# Altium schematic sheet Whitespace_Daughtercard_notes.SchDoc: Misc. Project Notes
size A; Author: Ryan E. Guerra; Revision: 1.0; SheetNumber: 10; SheetTotal: 10
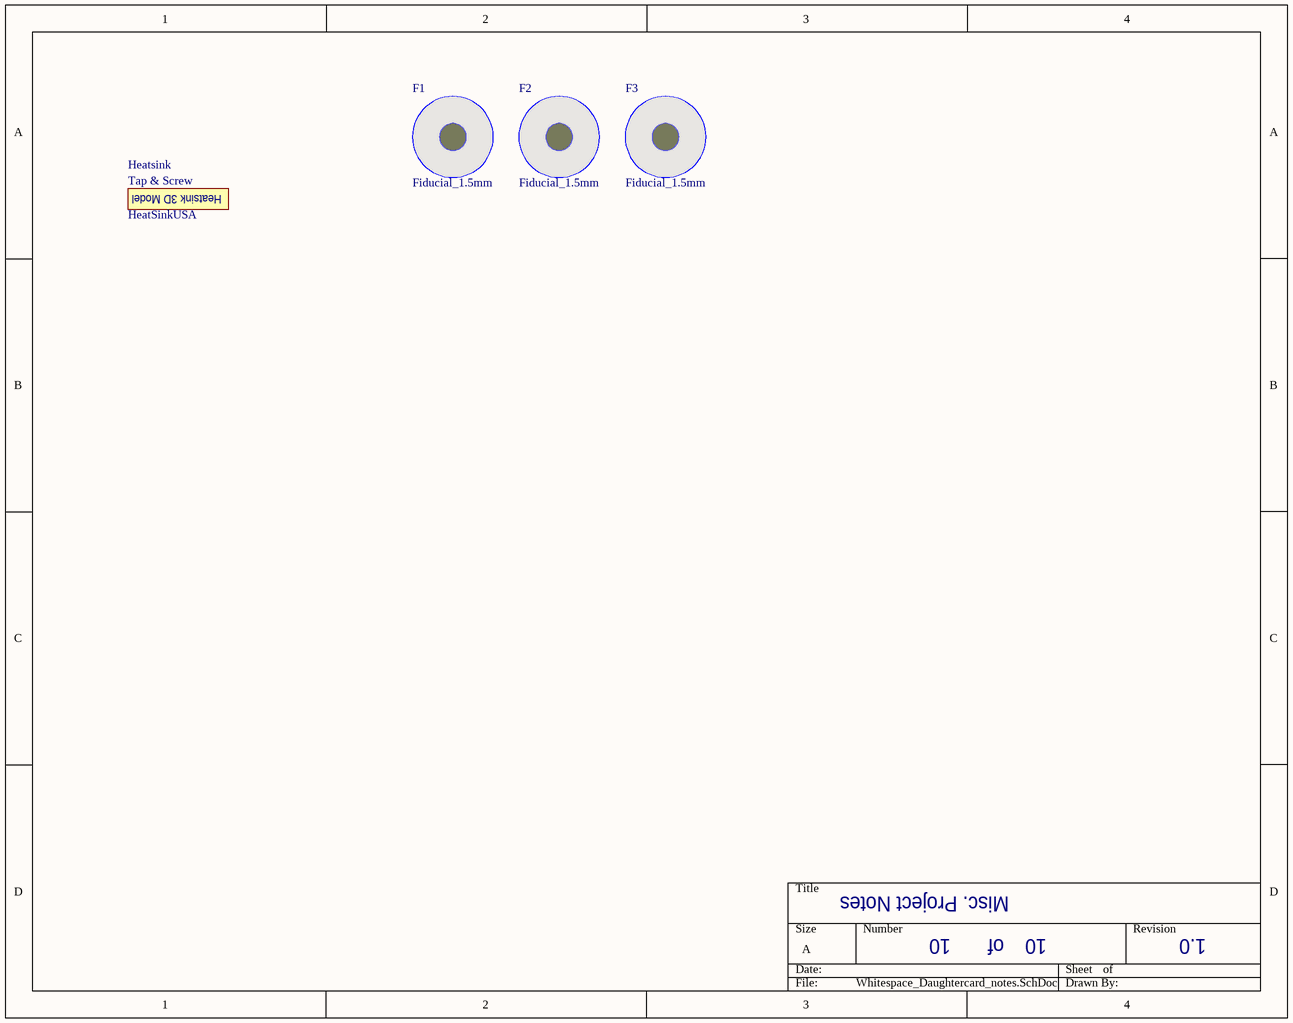
[diagram p0: Whitespace_Daughtercard_notes.SchDoc]

## Parts
F1  Fiducial_1.5mm  [1.5mm_FIDUCIAL_v4]
F2  Fiducial_1.5mm  [1.5mm_FIDUCIAL_v4]
F3  Fiducial_1.5mm  [1.5mm_FIDUCIAL_v4]
Heatsink  Tap & Screw  Supplier 1: HeatSinkUSA  [HeatSinkUSA_1800]

## Notes on the sheet
- of
- (in symbol HeatSink) Heatsink 3D Model

## Library data of the parts
Heatsink = HeatSink: Supplier Part Number 1: 1.813" Wide Extruded Aluminum Heatsink